# Altium project motordriver-v6.0.PrjPcb (part 2 of 2)
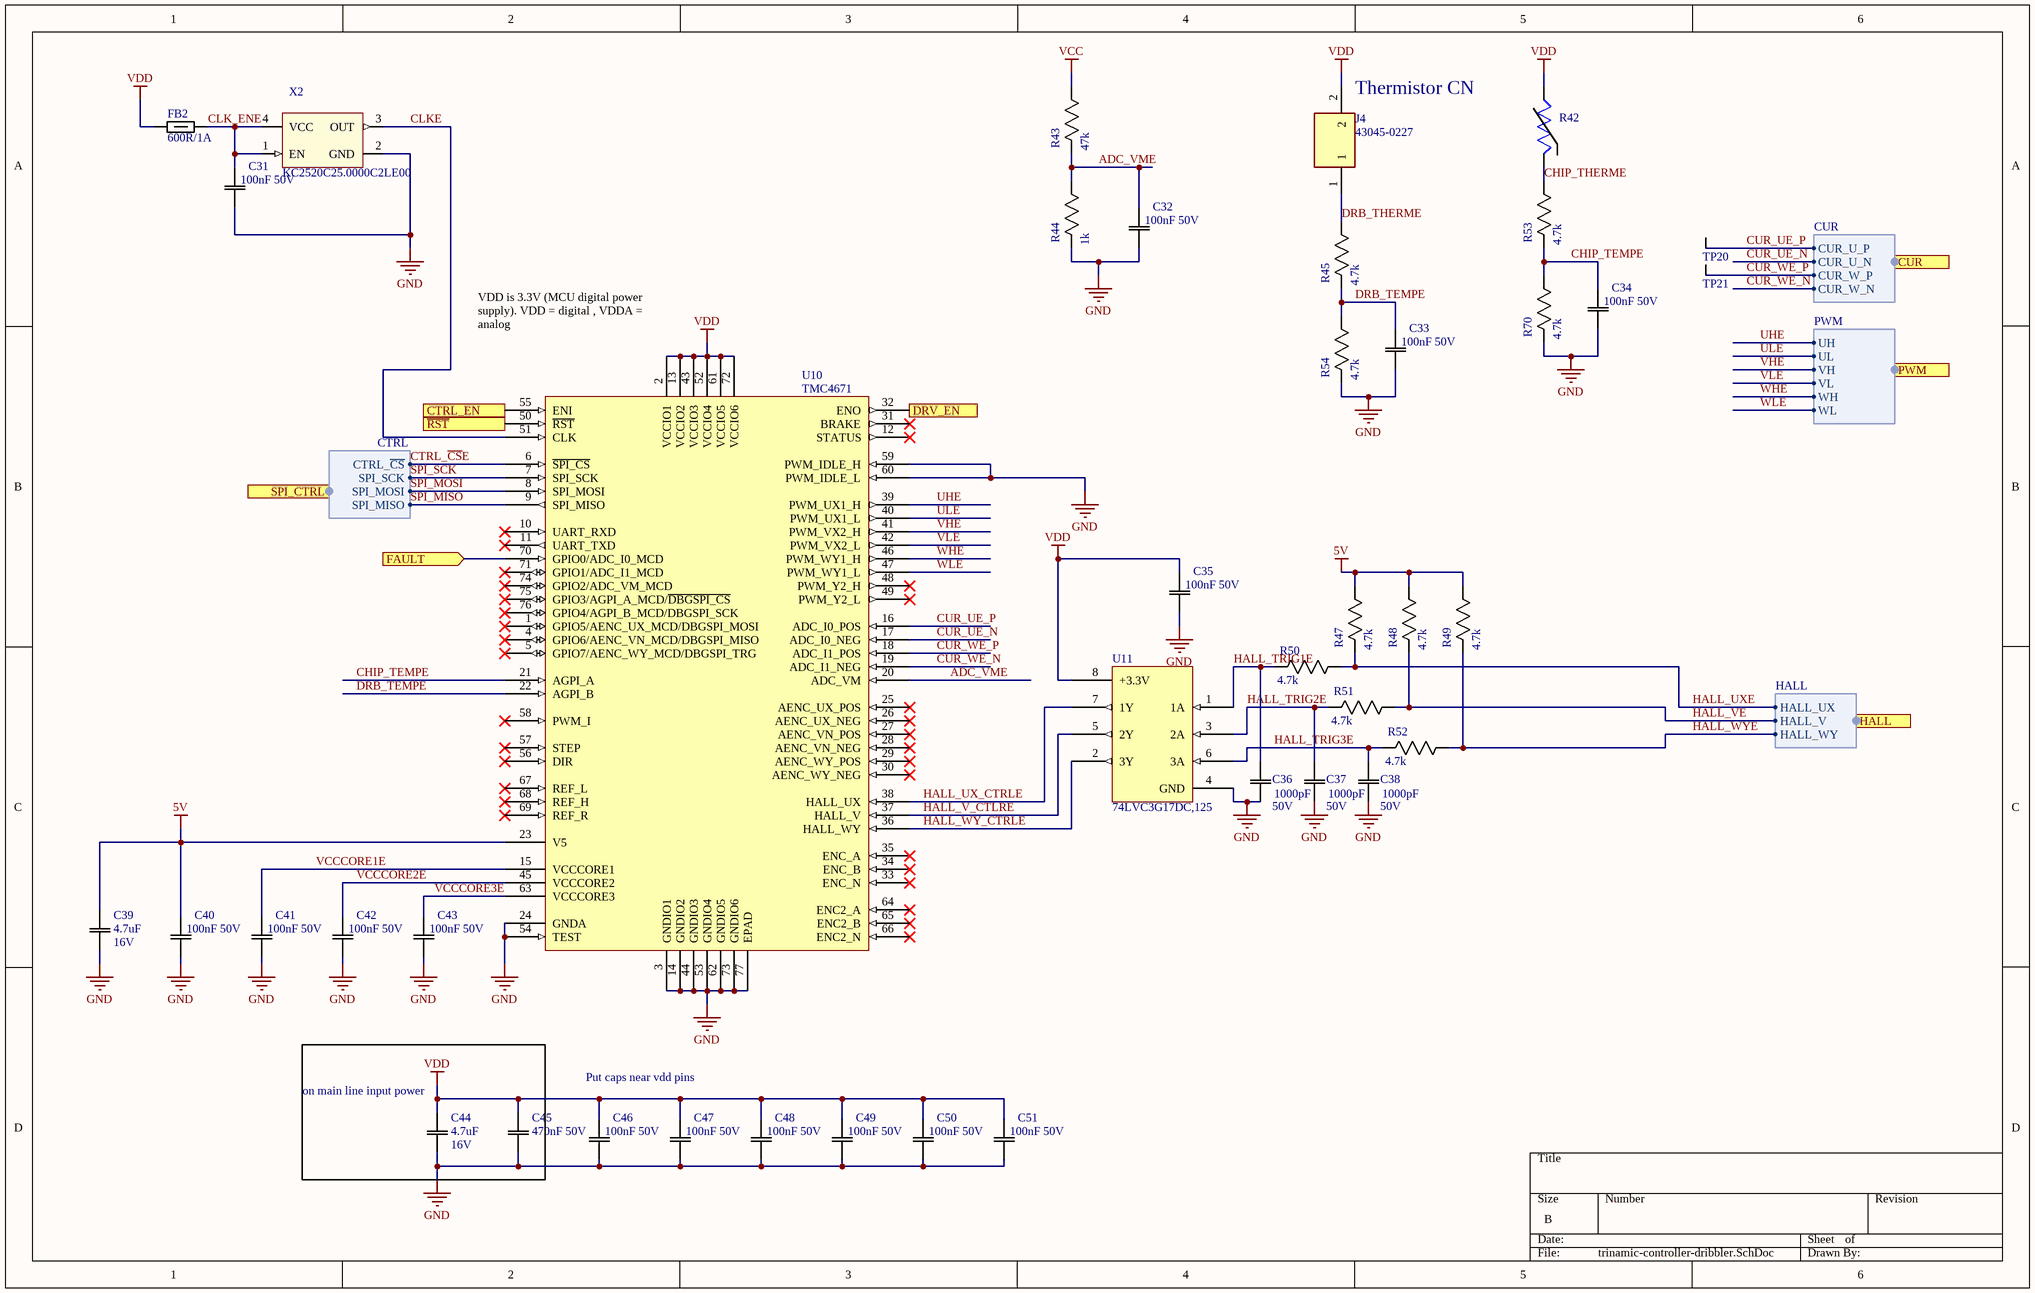
[diagram p7: trinamic-controller-dribbler.SchDoc]

## Nets that join several sheets
5V: power (6 pins), trinamic-controller-dribbler (6 pins)
GND: Driver Power Stage 0 (26 pins), Connectors 0 (J5A.2), power (12 pins), ui-jetson-nano (U2.7), UI-JETSON-NANO/U_isolation_0 (C4A.1 R15A.2 U5A.9 U5A.15), UI-JETSON-NANO/U_isolation_1 (C4B.1 R15B.2 U5B.9 U5B.15), UI-JETSON-NANO/U_isolation_2 (C4C.1 R15C.2 U5C.9 U5C.15), UI-JETSON-NANO/U_isolation_3 (C4D.1 R15D.2 U5D.9 U5D.15), trinamic-controller-dribbler (37 pins), Driver Power Stage 1 (26 pins), Connectors 1 (J5B.2), Driver Power Stage 2 (26 pins), Connectors 2 (J5C.2), Driver Power Stage 3 (26 pins), Connectors 3 (J5D.2)
JETSON_3V3: ui-jetson-nano (J2.14 J2.15), UI-JETSON-NANO/U_isolation_0 (C3A.2 U5A.1), UI-JETSON-NANO/U_isolation_1 (C3B.2 U5B.1), UI-JETSON-NANO/U_isolation_2 (C3C.2 U5C.1), UI-JETSON-NANO/U_isolation_3 (C3D.2 U5D.1)
JETSON_GND: ui-jetson-nano (J2.13), UI-JETSON-NANO/U_isolation_0 (C3A.1 R14A.2 U5A.2 U5A.8), UI-JETSON-NANO/U_isolation_1 (C3B.1 R14B.2 U5B.2 U5B.8), UI-JETSON-NANO/U_isolation_2 (C3C.1 R14C.2 U5C.2 U5C.8), UI-JETSON-NANO/U_isolation_3 (C3D.1 R14D.2 U5D.2 U5D.8)
VCC: Driver Power Stage 0 (20 pins), power (5 pins), trinamic-controller-dribbler (R43.1), Driver Power Stage 1 (20 pins), Driver Power Stage 2 (20 pins), Driver Power Stage 3 (20 pins)
VDD: Driver Power Stage 0 (C74A.1 R38A.2 U14A.16), Connectors 0 (J5A.3), power (C2.2 R11.2 TP6.1 U1.2), ui-jetson-nano (5 pins), UI-JETSON-NANO/U_isolation_0 (C4A.2 U5A.16), UI-JETSON-NANO/U_isolation_1 (C4B.2 U5B.16), UI-JETSON-NANO/U_isolation_2 (C4C.2 U5C.16), UI-JETSON-NANO/U_isolation_3 (C4D.2 U5D.16), trinamic-controller-dribbler (19 pins), Driver Power Stage 1 (C74B.1 R38B.2 U14B.16), Connectors 1 (J5B.3), Driver Power Stage 2 (C74C.1 R38C.2 U14C.16), Connectors 2 (J5C.3), Driver Power Stage 3 (C74D.1 R38D.2 U14D.16), Connectors 3 (J5D.3)
CS0: ui-jetson-nano (J2.2), UI-JETSON-NANO/U_isolation_1 (U5B.4)
CS1: ui-jetson-nano (J2.3), UI-JETSON-NANO/U_isolation_1 (U5B.5)
CS2: ui-jetson-nano (J2.4), UI-JETSON-NANO/U_isolation_2 (U5C.3)
CS3: ui-jetson-nano (J2.5), UI-JETSON-NANO/U_isolation_2 (U5C.4)
CS4: ui-jetson-nano (J2.6), UI-JETSON-NANO/U_isolation_2 (U5C.5)
CTRL_EN: ui-jetson-nano (J2.11), UI-JETSON-NANO/U_isolation_3 (U5D.3)
CTRL_EN_ISO: UI-JETSON-NANO/U_isolation_3 (U5D.14), trinamic-controller-dribbler (U10.55)
DRV_~{CS}: Driver Power Stage 0 (U14A.10), ui-jetson-nano (R2.2 U2.4)
DRV_~{CS}: ui-jetson-nano (R4.2 U2.13), Driver Power Stage 1 (U14B.10)
MISO: ui-jetson-nano (J2.9), UI-JETSON-NANO/U_isolation_0 (U5A.6)
MISO_DRV0: Driver Power Stage 0 (U14A.13), ui-jetson-nano (U2.5)
MISO_DRV1: ui-jetson-nano (U2.12), Driver Power Stage 1 (U14B.13)
MISO_ISO: Connectors 0 (J8A.3 TP30A.1), ui-jetson-nano (U2.3 U2.6 U2.8 U2.11), UI-JETSON-NANO/U_isolation_0 (U5A.11), Connectors 1 (J8B.3 TP30B.1), Connectors 2 (J8C.3 TP30C.1), Connectors 3 (J8D.3 TP30D.1)
MOSI: ui-jetson-nano (J2.10), UI-JETSON-NANO/U_isolation_0 (U5A.5)
MOSI_ISO: Driver Power Stage 0 (U14A.12), Connectors 0 (J8A.4 TP29A.1), UI-JETSON-NANO/U_isolation_0 (U5A.12), trinamic-controller-dribbler (U10.8), Driver Power Stage 1 (U14B.12), Connectors 1 (J8B.4 TP29B.1), Driver Power Stage 2 (U14C.12), Connectors 2 (J8C.4 TP29C.1), Driver Power Stage 3 (U14D.12), Connectors 3 (J8D.4 TP29D.1)
MUX_SEL_0: ui-jetson-nano (J2.1), UI-JETSON-NANO/U_isolation_1 (U5B.3)
MUX_SEL_1: ui-jetson-nano (J2.7), UI-JETSON-NANO/U_isolation_0 (U5A.3)
SCK: ui-jetson-nano (J2.8), UI-JETSON-NANO/U_isolation_0 (U5A.4)
SCK_ISO: Driver Power Stage 0 (U14A.11), Connectors 0 (J8A.2 TP31A.1), UI-JETSON-NANO/U_isolation_0 (U5A.13), trinamic-controller-dribbler (U10.7), Driver Power Stage 1 (U14B.11), Connectors 1 (J8B.2 TP31B.1), Driver Power Stage 2 (U14C.11), Connectors 2 (J8C.2 TP31C.1), Driver Power Stage 3 (U14D.11), Connectors 3 (J8D.2 TP31D.1)
U: Driver Power Stage 0 (R60A.1 TP13A.1), Connectors 0 (J3A.1)
U: Driver Power Stage 1 (R60B.1 TP13B.1), Connectors 1 (J3B.1)
U: Driver Power Stage 2 (R60C.1 TP13C.1), Connectors 2 (J3C.1)
U: Driver Power Stage 3 (R60D.1 TP13D.1), Connectors 3 (J3D.1)
V: Driver Power Stage 0 (R66A.1 TP15A.1), Connectors 0 (J3A.2)
V: Driver Power Stage 1 (R66B.1 TP15B.1), Connectors 1 (J3B.2)
V: Driver Power Stage 2 (R66C.1 TP15C.1), Connectors 2 (J3C.2)
V: Driver Power Stage 3 (R66D.1 TP15D.1), Connectors 3 (J3D.2)
W: Driver Power Stage 0 (R74A.1 TP17A.1), Connectors 0 (J3A.3)
W: Driver Power Stage 1 (R74B.1 TP17B.1), Connectors 1 (J3B.3)
W: Driver Power Stage 2 (R74C.1 TP17C.1), Connectors 2 (J3C.3)
W: Driver Power Stage 3 (R74D.1 TP17D.1), Connectors 3 (J3D.3)
~RST: ui-jetson-nano (J2.12), UI-JETSON-NANO/U_isolation_3 (U5D.4)
~RST_ISO: UI-JETSON-NANO/U_isolation_3 (U5D.13), trinamic-controller-dribbler (U10.50)